# Altium project Instrumentdroid.PrjPcb
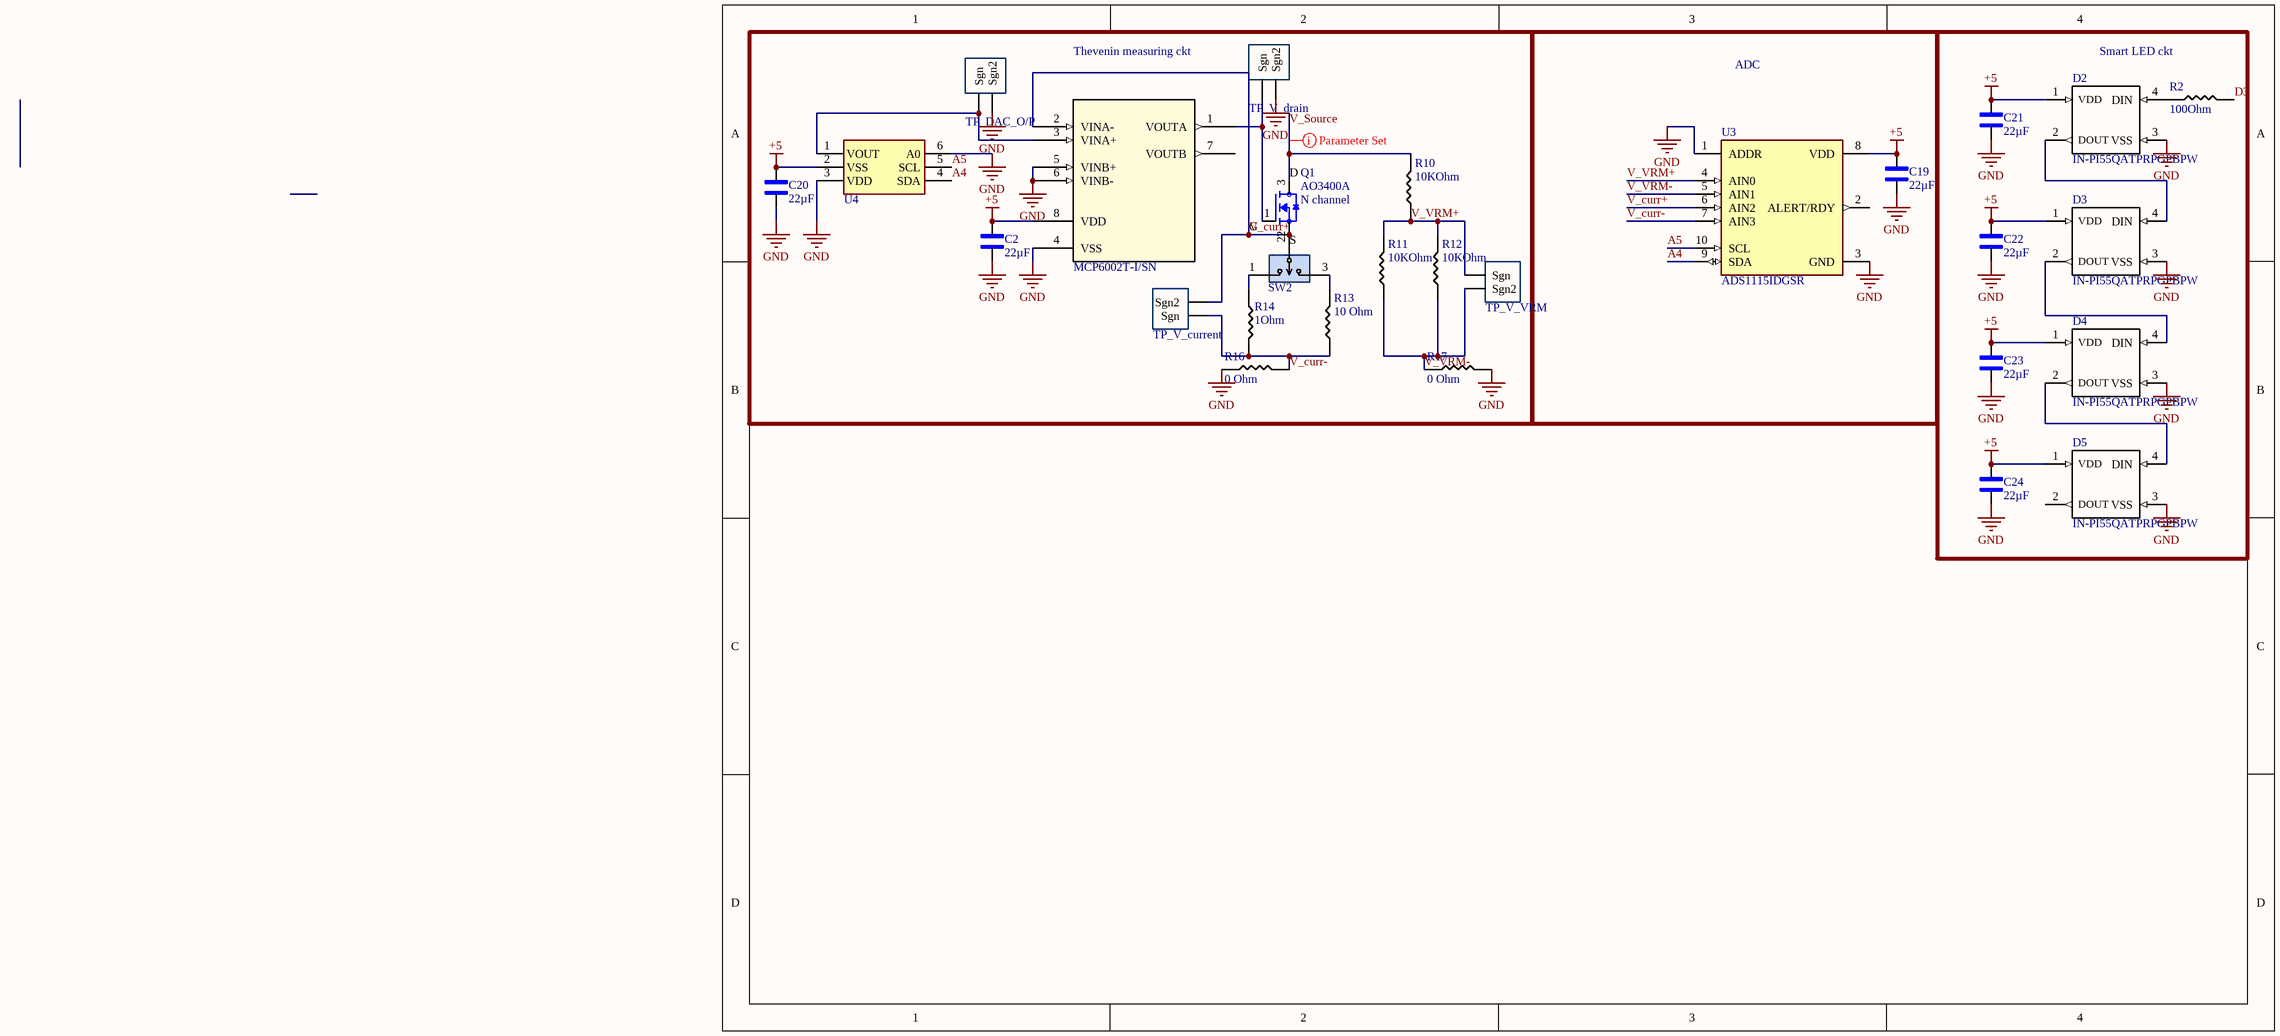
[diagram p0: Sheet2.SchDoc]
2 sheets, 81 parts. Net scope: global (net labels, ports and power ports of the same name join across sheets).
Board file: PCB1_backup1.PcbDoc
Sheets:
  Sheet2.SchDoc
  Sheet3.SchDoc

## Sheet Sheet2.SchDoc
size A4; SheetNumber: 1; SheetTotal: 2

### Parts
?  MCP6002T-I/SN  [SOIC127P600X175-8N]
C2  value 22µF  [1206_Passive_Capacitor]  (hidden comment: C_22uF_1206)
C19  value 22µF  [1206_Passive_Capacitor]  (hidden comment: C_22uF_1206)
C20  value 22µF  [1206_Passive_Capacitor]  (hidden comment: C_22uF_1206)
C21  value 22µF  [1206_Passive_Capacitor]  (hidden comment: C_22uF_1206)
C22  value 22µF  [1206_Passive_Capacitor]  (hidden comment: C_22uF_1206)
C23  value 22µF  [1206_Passive_Capacitor]  (hidden comment: C_22uF_1206)
C24  value 22µF  [1206_Passive_Capacitor]  (hidden comment: C_22uF_1206)
D2  IN-PI55QATPRPGPBPW  [SERIAL_LED - duplicate]
D3  IN-PI55QATPRPGPBPW  [SERIAL_LED - duplicate]
D4  IN-PI55QATPRPGPBPW  [SERIAL_LED - duplicate]
D5  IN-PI55QATPRPGPBPW  [SERIAL_LED - duplicate]
Q1  AO3400A  value N channel  [N-MOSFET]
R2  100Ohm  [1206_Passive_Resitor]
R10  value 10KOhm  [1206_Passive_Resitor]  (hidden comment: 10k)
R11  value 10KOhm  [1206_Passive_Resitor]  (hidden comment: 10k)
R12  value 10KOhm  [1206_Passive_Resitor]  (hidden comment: 10k)
R13  10 Ohm  [1206_Passive_Resitor]
R14  value 1Ohm  [1206_Passive_Resitor]  (hidden comment: 1 Ohm)
R16  0 Ohm  [1206_Passive_Resitor]
R17  0 Ohm  [1206_Passive_Resitor]
SW2  SW_3Pin_100mil_Switch  [3_PIN_100mil]  (value not drawn)
TP_DAC_O/P  10x Probe TP  [TP_Diff_Probe]  (value not drawn)
TP_V_current  10x Probe TP  [TP_Diff_Probe]  (value not drawn)
TP_V_drain  10x Probe TP  [TP_Diff_Probe]  (value not drawn)
TP_V_VRM  10x Probe TP  [TP_Diff_Probe]  (value not drawn)
U3  ADS1115IDGSR  [ADC_ADS1115IDGSR]
U4  DAC IC  [MCP4725]  (value not drawn)

### Blocks framed on the sheet
Thevenin measuring ckt: ? C2 C20 Q1 R10-R14 R16 R17 SW2 TP_DAC_O/P TP_V_current TP_V_drain TP_V_VRM U4
ADC: C19 U3
Smart LED ckt: C21-C24 D2-D5 R2

### Nets
+5: ?.8(VDD) C2.1 C19.1 C20.1 C21.1 C22.1 C23.1 C24.1 D2.1(VDD) D3.1(VDD) D4.1(VDD) D5.1(VDD) U3.8(VDD) U4.2(VSS)
GND: ?.4(VSS) ?.5(VINB+) ?.6(VINB-) C2.2 C19.2 C20.2 C21.2 C22.2 C23.2 C24.2 D2.3(VSS) D3.3(VSS) D4.3(VSS) D5.3(VSS) R16.1 R17.2 TP_DAC_O/P.2(Sgn2) TP_V_drain.2(Sgn2) U3.1(ADDR) U3.3(GND) U4.3(VDD) U4.6(A0)
A4: U3.9(SDA) U4.4(SDA)
A5: U3.10(SCL) U4.5(SCL)
D3: R2.2
V_curr+: ?.2(VINA-) Q1.2(S) SW2.2 TP_V_current.2(Sgn2) U3.6(AIN2)
V_curr-: R13.1 R14.2 R16.2 TP_V_current.1(Sgn) U3.7(AIN3)
V_Source: Q1.3(D) R10.2
V_VRM+: R10.1 R11.2 R12.2 TP_V_VRM.1(Sgn) U3.4(AIN0)
V_VRM-: R11.1 R12.1 R17.1 TP_V_VRM.2(Sgn2) U3.5(AIN1)
Net?_1: ?.1(VOUTA) Q1.1(G) TP_V_drain.1(Sgn)
Net?_3: ?.3(VINA+) TP_DAC_O/P.1(Sgn) U4.1(VOUT)
NetD2_2: D2.2(DOUT) D3.4(DIN)
NetD2_4: D2.4(DIN) R2.1
NetD3_2: D3.2(DOUT) D4.4(DIN)
NetD4_2: D4.2(DOUT) D5.4(DIN)
NetR13_2: R13.2 SW2.3
NetR14_1: R14.1 SW2.1

Not connected (* = marked no-connect by the designer): ? 7(VOUTB); D5 2(DOUT); U3 2(ALERT/RDY)

### Layout directives
rule Width Constraint [Pref Width = 20mil    Min Width = 20mil    Max Width = 20mil]: V_Source

### Library data of the parts
? = U_MCP6002T-I/SN: 0.6 V/us 2 1MHz 1.8V ~ 6V 100μA General Purpose SOIC-8_150mil  Operational Amplifier ROHS; Mfr: Microchip; MFR Part #: MCP6002T-I/SN; DataSheet: https://ww1.microchip.com/downloads/en/DeviceDoc/MCP6001-1R-1U-2-4-1-MHz-Low-Power-Op-Amp-DS20001733L.pdf; LCSC Part#: C7377; Type: Basic
C2 C19-C24 = CMP-001-00089-1: 22uF ±10% 25V X5R 1206 Multilayer Ceramic Capacitors MLCC - SMD/SMT RoHS; MFR Part #: CL31A226KAHNNNE; Type: basic; Design Item ID: C_22uF_1206; Datasheet: https://datasheet.lcsc.com/lcsc/1811031514_Samsung-Electro-Mechanics-CL31A226KAHNNNE_C12891.pdf; LCSC Part#: C12891; Component Type: Standard; Pins: 2; Source: ECEN5730Lib_2023_05_DS.SchLib
D2-D5 = LED_Smart: LIGHT EMITTING DIODES (LED) RGB 620~630NM RED, 520~530NM GREEN, 465~475NM BLUE 600MCD@16MARED,1200MCD@16MAGREEN,300MCD@16MABLUE TOP VIEW SMD-4 ROHS; MFR Part #: XL-5050RGBC-WS2812B; Manufacturer: XINGLIGHT; LCSC Part#: C2843785; DataSheet: https://datasheet.lcsc.com/lcsc/2301111130_XINGLIGHT-XL-5050RGBC-WS2812B_C2843785.pdf
Q1 = Q_Nch_MOSFET: MOSFET N Trench 30V 5.7A 1.5V @ 250uA 26.5 m? @ 5.7A,10V SOT-23-3L RoHS; Type: Basic; LCSC Part#: C20917; Datasheet: https://datasheet.lcsc.com/szlcsc/Alpha-Omega-Semicon-AOS-AO3400A_C20917.pdf; MFR Part #: AO3400A
R2 = R_100Ohm_1206: 100Ω ±1% 0.25W ±100ppm/℃ 1206 Chip Resistor - Surface Mount RoHS; MFR Part #: 1206W4F1000T5E; LCSC Part#: C17901; Datasheet: https://datasheet.lcsc.com/lcsc/2206010145_UNI-ROYAL-Uniroyal-Elec-1206W4F1000T5E_C17901.pdf; Type: Basic; Value: 100Ohm
R10-R12 = R_10KOhm_1206: 10 kOhms ±5% 0.25W, 1/4W Chip Resistor 1206 (3216 Metric) Automotive AEC-Q200 Thick Film; MFR Part #: RMCF1206FT10K0; Digikey Link: https://www.digikey.com/en/products/detail/stackpole-electronics-inc/RMCF1206FT10K0/1759669; LCSC Part#: C17902; Type: Basic
R13 = R_10Ohm_1206: CHIP RESISTOR - SURFACE MOUNT 0.1OHMS ±1% 1/4W 1206 ROHS; MFR Part #: 1206W4F100JT5E; Datasheet: https://datasheet.lcsc.com/szlcsc/Uniroyal-Elec-1206W4F100JT5E_C17903.pdf; LCSC Part#: C17903; Type: Basic; Value: 10 Ohm
R14 = R_1Ohm_1206: 1Ω ±5% 0.25W ±400ppm/℃ 1206 Chip Resistor - Surface Mount RoHS; MFR Part #: 1206W4J010JT5E; LCSC Part#: C1409; Datasheet: https://datasheet.lcsc.com/lcsc/1810301410_UNI-ROYAL-Uniroyal-Elec-1206W4J010JT5E_C1409.pdf; Type: Extended
R16 R17 = R_0Ohm_1206: CHIP RESISTOR - SURFACE MOUNT 0OHMS ±1% 1/4W 1206 ROHS; MFR Part #: 1206W4F0000T5E; Datasheet: https://datasheet.lcsc.com/szlcsc/Uniroyal-Elec-1206W4F0000T5E_C17888.pdf; LCSC Part#: C17888; Type: Basic; Mouser link: https://www.mouser.com/ProductDetail/Royalohm/1206W4F0000T5E?qs=e8oIoAS2J1Thbopin%252BsagQ%3D%3D; Value: 0 Ohm
SW2 = CMP-002-00126-1: Connector Header Through Hole 3 position 0.100" (2.54mm); MFR Part #: PREC003SAAN-RC; Value: CONN HEADER VERT 3POS 2.54MM; Type: Extended; LCSC Part#: C49257; Source: ECEN5730Lib_2023_05_DS.SchLib; Pins: 3; Design Item ID: SW_3Pin_100mil_Switch; Component Type: Standard; Digikey Link: https://www.digikey.com/product-detail/en/PREC003SAAN-RC/S1012EC-03-ND/2774851/?itemSeq=304982371
TP_DAC_O/P TP_V_current TP_V_drain TP_V_VRM = TP_Diff_Probe: Test Point 300 mil centers
U3 = U_ADC_ADS1115IDGSR: 16-Bit ADC with Integrated MUX, PGA, Comparator, Oscillator, and Reference 10-VSSOP -40 to 125; MFR Part #: ADS1115IDGSR; Package: MSOP-10 Texas Instruments; LCSC Part#: C37593; SnapEDA_Link: https://www.snapeda.com/parts/ADS1115IDGSR/Texas%20Instruments/view-part/?ref=snap; Type: Extended; DigiKey link: https://www.digikey.com/product-detail/en/texas-instruments/ADS1115IDGSR/296-38849-1-ND/5142969?utm_source=snapeda&utm_medium=aggregator&utm_campaign=symbol; Value: *
U4 = U_MCP4725A0T-E/CH: IC DAC 12BIT V-OUT SOT23-6; Datasheet: https://ww1.microchip.com/downloads/en/DeviceDoc/22039d.pdf; LCSC Part#: C144198; type: Extended; MFR Part #: MCP4725A0T-E/CH

## Sheet Sheet3.SchDoc
size A4; SheetNumber: 2; SheetTotal: 2
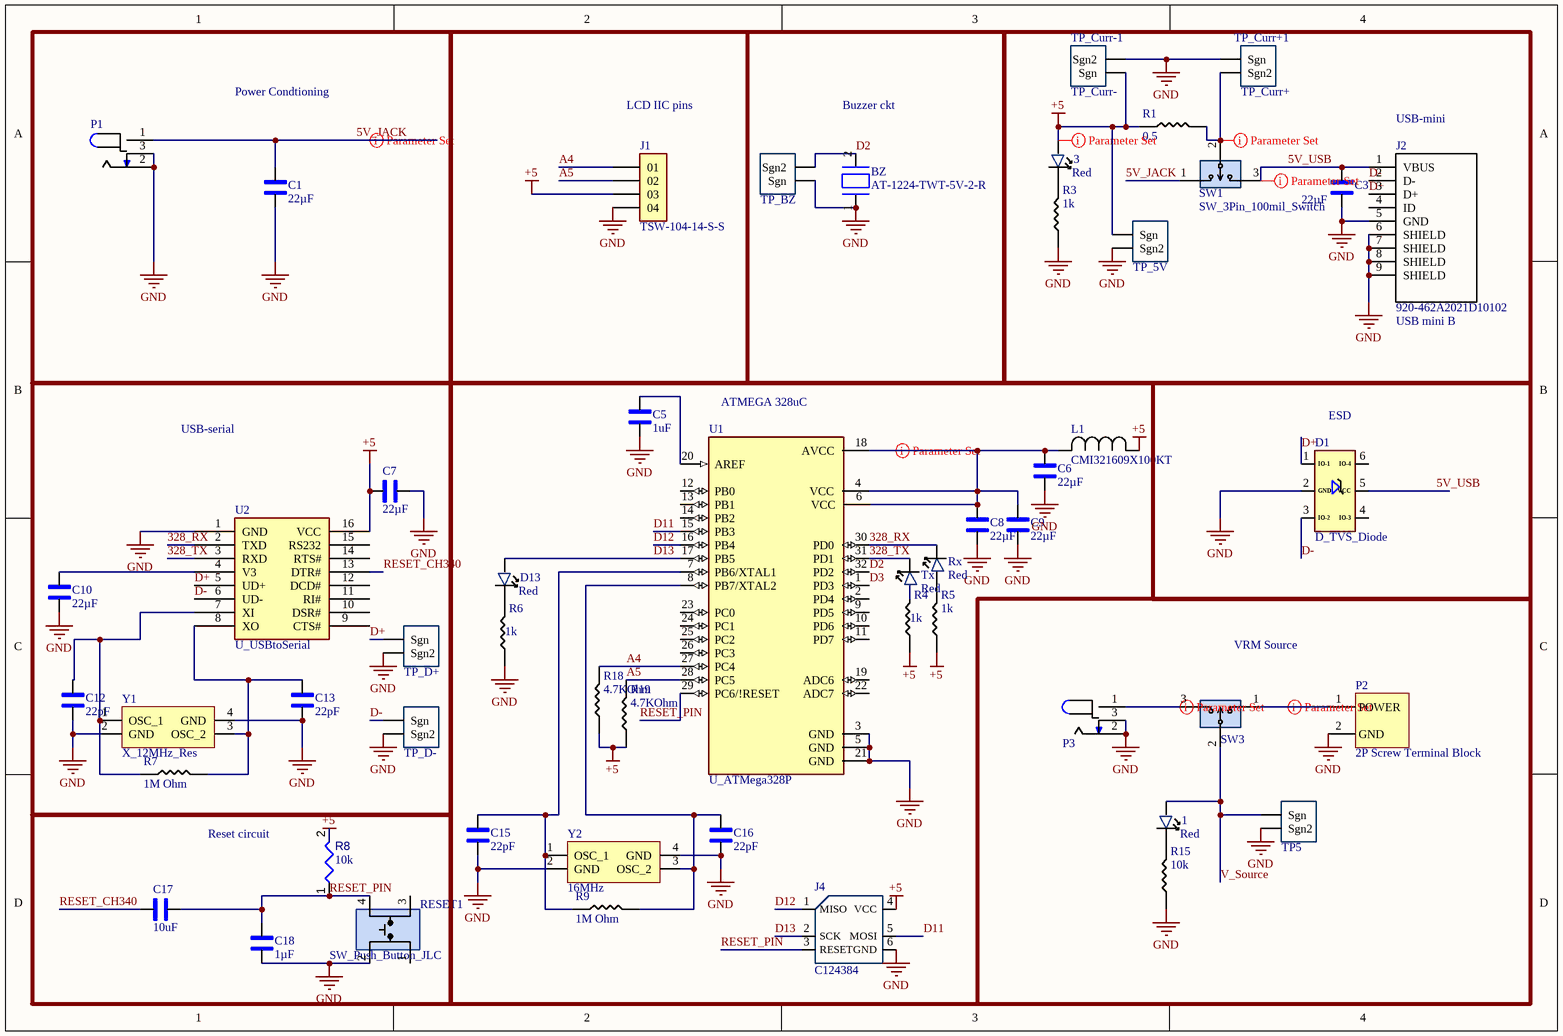
[diagram p1: Sheet3.SchDoc]

### Parts
1  value Red  [LED_1206]  (hidden comment: LED_RED_1206)
3  value Red  [LED_1206]  (hidden comment: LED_RED_1206)
BZ  AT-1224-TWT-5V-2-R  [BUZZER- TH]
C1  value 22µF  [1206_Passive_Capacitor]  (hidden comment: C_22uF_1206)
C3  value 22µF  [1206_Passive_Capacitor]  (hidden comment: C_22uF_1206)
C5  1uF  [1206_Passive_Capacitor]
C6  value 22µF  [1206_Passive_Capacitor]  (hidden comment: C_22uF_1206)
C7  value 22µF  [1206_Passive_Capacitor]  (hidden comment: C_22uF_1206)
C8  value 22µF  [1206_Passive_Capacitor]  (hidden comment: C_22uF_1206)
C9  value 22µF  [1206_Passive_Capacitor]  (hidden comment: C_22uF_1206)
C10  value 22µF  [1206_Passive_Capacitor]  (hidden comment: C_22uF_1206)
C12  value 22pF  [1206_Passive_Capacitor]  (hidden comment: C_22uF_1206)
C13  value 22pF  [1206_Passive_Capacitor]  (hidden comment: C_22uF_1206)
C15  value 22pF  [1206_Passive_Capacitor]  (hidden comment: C_22uF_1206)
C16  value 22pF  [1206_Passive_Capacitor]  (hidden comment: C_22uF_1206)
C17  10uF  [1206_Passive_Capacitor]
C18  value 1µF  [1206_Passive_Capacitor]  (hidden comment: C_1uF_1206)
D1  D_TVS_Diode  [TVS]
D13  value Red  [LED_1206]  (hidden comment: LED_RED_1206)
J1  TSW-104-14-S-S  [JM-4_TSW-104-14-S-S]
J2  value USB mini B  MFR Part #: 920-462A2021D10102  [USB_MINI_B]  (hidden comment: J_USB_B_Mini)
J4  LCSC Part#: C124384  [ICSP]  (hidden comment: NRPN032PAEN-RC)
L1  MFR PART #: CMI321609X100KT  [AIML-1206_ABR-M]  (hidden comment: FB_10uH_1206)
P1  P_Power Jack  [Power_Jack]  (value not drawn)
P2  2P Screw Terminal Block  [P_Terminal block 3.5mm-pitch]
P3  Power Jack  [Power_Jack]  (value not drawn)
R1  value 0.5  [1206_Passive_Resitor]  (hidden comment: R_500mOhm_1206)
R3  value 1k  [1206_Passive_Resitor]  (hidden comment: R_1K_1206)
R4  value 1k  [1206_Passive_Resitor]  (hidden comment: R_1K_1206)
R5  value 1k  [1206_Passive_Resitor]  (hidden comment: R_1K_1206)
R6  value 1k  [1206_Passive_Resitor]  (hidden comment: R_1K_1206)
R7  value 1M Ohm  [1206_Passive_Resitor]  (hidden comment: 1M)
R8  value 10k  [RESC3216X60X45ML15T20]  (hidden comment: Resistor 10k +/-1% 1206 250 mW)
R9  value 1M Ohm  [1206_Passive_Resitor]  (hidden comment: 1M)
R15  value 10k  [1206_Passive_Resitor]  (hidden comment: R_10K_1206)
R18  4.7KOhm  [1206_Passive_Resitor]
R19  4.7KOhm  [1206_Passive_Resitor]
RESET1  SW_Push_Button_JLC  [Switch_JLC]
Rx  value Red  [LED_1206]  (hidden comment: LED_RED_1206)
SW1  SW_3Pin_100mil_Switch  [3_PIN_100mil]
SW3  SW_3Pin_100mil_Switch  [3_PIN_100mil]  (value not drawn)
TP5  10x Probe TP  [TP_Diff_Probe]  (value not drawn)
TP_5V  10x Probe TP  [TP_Diff_Probe]  (value not drawn)
TP_BZ  10x Probe TP  [TP_Diff_Probe]  (value not drawn)
TP_Curr+1  TP_Curr+  [TP_Diff_Probe]
TP_Curr-1  TP_Curr-  [TP_Diff_Probe]
TP_D+  10x Probe TP  [TP_Diff_Probe]  (value not drawn)
TP_D-  10x Probe TP  [TP_Diff_Probe]  (value not drawn)
Tx  value Red  [LED_1206]  (hidden comment: LED_RED_1206)
U1  U_ATMega328P  [ATMega328P]
U2  U_USBtoSerial  [USB to serial]
Y1  X_12MHz_Res  [Crystal resonator]
Y2  value 16MHz  [Crystal resonator]  (hidden comment: X322516MLB4SI)

### Blocks framed on the sheet
Power Condtioning: C1 P1
Buzzer ckt: BZ TP_BZ
LCD IIC pins: J1
USB-mini: 3 C3 J2 R1 R3 SW1 TP_5V TP_Curr+1 TP_Curr-1
USB-serial: C7 C10 C12 C13 R7 TP_D+ TP_D- U2 Y1
ATMEGA 328uC: C5 C6 C8 C9 C15 C16 D13 J4 L1 R4-R6 R9 R18 R19 Rx Tx U1 Y2
ESD: D1
VRM Source: 1 P2 P3 R15 SW3 TP5
Reset circuit: C17 C18 R8 RESET1

### Nets
+5: 3.1 C7.1 J1.03 J4.4(VCC) L1.1 R1.1 R4.1 R5.1 R8.2 R18.1 R19.1 TP_5V.1(Sgn) TP_Curr-1.1(Sgn) U2.16(VCC)
GND: BZ.1(BZ1) C1.1 C3.1 C5.2 C6.1 C7.2 C8.1 C9.1 C10.2 C12.1 C13.1 C15.1 C16.1 C18.1 D1.2(GND) J1.04 J2.5(GND) J2.6(SHIELD) J2.7(SHIELD) J2.8(SHIELD) J2.9(SHIELD) J4.6(GND) P1.2 P1.3 P2.2(GND) P3.2 P3.3 R3.1 R6.1 R15.1 RESET1.2 TP5.2(Sgn2) TP_5V.2(Sgn2) TP_BZ.1(Sgn) TP_Curr+1.1(Sgn) TP_Curr-1.2(Sgn2) TP_D+.2(Sgn2) TP_D-.2(Sgn2) U1.3(GND) U1.5(GND) U1.21(GND) U2.1(GND) Y1.2(GND) Y1.4(GND) Y2.2(GND) Y2.4(GND)
5V_JACK: C1.2 P1.1 SW1.1
5V_USB: C3.2 D1.5(VCC) J2.1(VBUS) SW1.3
328_RX: Rx.2 U1.30(PD0) U2.2(TXD)
328_TX: Tx.2 U1.31(PD1) U2.3(RXD)
A4: J1.01 R18.2 U1.27(PC4)
A5: J1.02 R19.2 U1.28(PC5)
D2: BZ.2(BZ2) TP_BZ.2(Sgn2) U1.32(PD2)
D3: U1.1(PD3)
D11: J4.5(MOSI) U1.15(PB3)
D12: J4.1(MISO) U1.16(PB4)
D13: D13.1 J4.2(SCK) U1.17(PB5)
D+: D1.1(IO-1) J2.3(D+) TP_D+.1(Sgn) U2.5(UD+)
D-: D1.3(IO-2) J2.2(D-) TP_D-.1(Sgn) U2.6(UD-)
RESET_CH340: C17.1 U2.13(DTR#)
RESET_PIN: C17.2 C18.2 J4.3(RESET) R8.1 RESET1.4 U1.29(PC6/!RESET)
V_Source: 1.1 SW3.2 TP5.1(Sgn)
Net1_2: 1.2 R15.2
Net3_2: 3.2 R3.2
NetC5_1: C5.1 U1.20(AREF)
NetC6_2: C6.2 C8.2 C9.2 L1.2 U1.4(VCC) U1.6(VCC) U1.18(AVCC)
NetC10_1: C10.1 U2.4(V3)
NetC12_2: C12.2 R7.1 U2.7(XI) Y1.1(OSC_1)
NetC13_2: C13.2 R7.2 U2.8(XO) Y1.3(OSC_2)
NetC15_2: C15.2 R9.1 U1.7(PB6/XTAL1) Y2.1(OSC_1)
NetC16_2: C16.2 R9.2 U1.8(PB7/XTAL2) Y2.3(OSC_2)
NetD13_2: D13.2 R6.2
NetP2_1: P2.1(POWER) SW3.1
NetP3_1: P3.1 SW3.3
NetR1_2: R1.2 SW1.2 TP_Curr+1.2(Sgn2)
NetR4_2: R4.2 Tx.1
NetR5_2: R5.2 Rx.1

Not connected (* = marked no-connect by the designer): D1 4(IO-3) 6(IO-4); J2 4(ID); RESET1 1 3; U1 2(PD4) 9(PD5) 10(PD6) 11(PD7) 12(PB0) 13(PB1) 14(PB2) 19(ADC6) 22(ADC7) 23(PC0) 24(PC1) 25(PC2) 26(PC3); U2 9(CTS#) 10(DSR#) 11(RI#) 12(DCD#) 14(RTS#) 15(RS232)

### Layout directives
rule Width Constraint [Pref Width = 20mil    Min Width = 20mil    Max Width = 30mil]: 5V_JACK, 5V_USB, +5, NetC6_2, NetR1_2
rule Width Constraint [Pref Width = 20mil    Min Width = 20mil    Max Width = 20mil]: NetP2_1, NetP3_1

### Library data of the parts
1 3 Rx Tx = CMP-007-00045-1: Red 621~631nm 1206 Light Emitting Diodes (LED) RoHS; MFR Part #: 15-21/R6C-FQ1R1B/2T; Source: ECEN5730Lib_2023_05_DS.SchLib; LCSC Part#: C93133; Design Item ID: LED_RED_1206; Type: Extended; Pins: 2; Component Type: Standard; Datasheet: https://datasheet.lcsc.com/szlcsc/1811151241_Everlight-Elec-15-21-R6C-FQ1R1B-2T_C93133.pdf
BZ = BUZZER_1: Buzzers Transducer, Externally Driven Electromechanical/Magnetic 5 V 40mA 2.4kHz 87dB @ 5V, 10cm Through Hole PC Pins; Datasheet: https://www.puiaudio.com/media/SpecSheet/AT-1224-TWT-5V-2-R.pdf; MFR Part #: AT-1224-TWT-5V-2-R
C1 C3 C7 C10 C12 C13 C15 C16 = CMP-001-00089-1: as C2 on sheet Sheet2; Design Item ID: C_22uF_1206; Datasheet: https://datasheet.lcsc.com/lcsc/1811031514_Samsung-Electro-Mechanics-CL31A226KAHNNNE_C12891.pdf; LCSC Part#: C12891; Component Type: Standard; Pins: 2; Source: ECEN5730Lib_2023_05_DS.SchLib
C5 = C_1uF_1206: MULTILAYER CERAMIC CAPACITORS MLCC - SMD/SMT 1UF 50V 1206 ROHS; MFR Part #: CL31B105KBHNNNE; Type: Basic; Digikey Link: https://www.digikey.com/product-detail/en/C1206C105M4RACTU/399-8150-1-ND/3471873/?itemSeq=304982366; LCSC Part#: C1848; Value: 1uF
C6 C8 C9 = CMP-001-00098-1: 22uF ±10% 25V X5R 1206 Multilayer Ceramic Capacitors MLCC - SMD/SMT RoHS; MFR Part #: CL31A226KAHNNNE; Type: basic; Design Item ID: C_22uF_1206; LCSC Part#: C12891; Datasheet: https://datasheet.lcsc.com/lcsc/1811031514_Samsung-Electro-Mechanics-CL31A226KAHNNNE_C12891.pdf; Pins: 2; Component Type: Standard; Source: ECEN5730Lib_2023_05_DS.SchLib
C17 = C_10uF_1206: 10uF ±10% 50V X5R 1206 Multilayer Ceramic Capacitors MLCC - SMD/SMT RoHS; MFR Part #: CL31A106KBHNNNE; Type: Basic; LCSC Part#: C13585; Datasheet: https://datasheet.lcsc.com/lcsc/1810221112_Samsung-Electro-Mechanics-CL31A106KBHNNNE_C13585.pdf; Value: 10uF
C18 = CMP-001-00095-1: MULTILAYER CERAMIC CAPACITORS MLCC - SMD/SMT 1UF 50V 1206 ROHS; MFR Part #: CL31B105KBHNNNE; Type: Basic; Source: ECEN5730Lib_2023_05_DS.SchLib; Pins: 2; Digikey Link: https://www.digikey.com/product-detail/en/C1206C105M4RACTU/399-8150-1-ND/3471873/?itemSeq=304982366; LCSC Part#: C1848; Component Type: Standard; Design Item ID: C_1uF_1206
D1 = CMP-004-00031-1: TVS SOT-23-6 ROHS; MFR Part #: SRV05-4-P-T7; Type: Basic; Value: TVS DIODE 5.5V 6TSOP; LCSC Part#: C85364; Pins: 6; Design Item ID: D_TVS_Diode; Datasheet: https://datasheet.lcsc.com/szlcsc/ProTek-Devices-SRV05-4-P-T7_C85364.pdf; Component Type: Standard; Source: ECEN5730Lib_2023_05_DS.SchLib
D13 = CMP-007-00045-1: Red 621~631nm 1206 Light Emitting Diodes (LED) RoHS; MFR Part #: 15-21/R6C-FQ1R1B/2T; Type: Extended; Source: ECEN5730Lib_2023_05_DS.SchLib; LCSC Part#: C93133; Design Item ID: LED_RED_1206; Pins: 2; Component Type: Standard; Datasheet: https://datasheet.lcsc.com/szlcsc/1811151241_Everlight-Elec-15-21-R6C-FQ1R1B-2T_C93133.pdf
J1 = JM_4_PIN_MALE: Square Pins 2.5mm 6mm -40℃~+105℃ 1 4 3mm 2.54mm Black 1x4P Straight,P=2.54mm  Pin Headers ROHS; MFR PART #: PZ254V-11-04P; MP: TSW-104-14-S-S; LCSC PART#: C2691448
J2 = CMP-013-000002-1: Through Hole USB Connectors RoHS; Type: Extended; Design Item ID: J_USB_B_Mini; LCSC Part#: C46398; Pin Count: 9; Component Type: Standard; Datasheet: https://datasheet.lcsc.com/szlcsc/2103081233_Jing-Extension-of-the-Electronic-Co-920-462A2021D10102_C46398.pdf; Source: ECEN5730Lib_2023_05_DS.SchLib
J4 = J_ICSP: Connector Header Through Hole 6 position 0.079" (2.00mm); Digikey Link: https://www.digikey.com/product-detail/en/NRPN032PAEN-RC/S5801-03-ND/804955/?itemSeq=304982355; MFR Part #: NRPN032PAEN-RC; Type: Extended
L1 = CMP-006-00021-1: 25mA 10uH ±10% 800mO 1206  Inductors (SMD) ROHS; Mfr_Name: FH (Guangdong Fenghua Advanced Tech); Type: Basic; LCSC PART#: C1051; Source: ECEN5730Lib_2023_05_DS.SchLib; Pins: 2; Design Item ID: FB_10uH_1206; DataSheet: https://datasheet.lcsc.com/lcsc/1810311314_FH--Guangdong-Fenghua-Advanced-Tech-CMI321609X100KT_C1051.pdf; Component Type: Standard
P1 = CMP-002-00097-1: Power Barrel Connector Jack 2.10mm ID (0.083"), 5.50mm OD (0.217") Through Hole, Right Angle; MFR Part #: PJ-102A; Value: CONN PWR JACK 2X5.5MM SOLDER; Component Type: Standard; LCSC Part#: C136744; Source: ECEN5730Lib_2023_05_DS.SchLib; Type: Extended; Digikey Link: https://www.digikey.com/product-detail/en/PJ-102A/CP-102A-ND/275425/?itemSeq=304982367; Pins: 3; Design Item ID: P_Power Jack
P2 = P_Terminal block: Green Straight pin 3.5mm  pitch; P=3.5mm  Screw terminal ROHS; MFR Part #: KF350-3.5-2P; Manufacturer: Cixi Kefa Elec; LCSC Part#: C474892; DataSheet: https://datasheet.lcsc.com/lcsc/2001160007_Cixi-Kefa-Elec-KF350-3-5-2P_C474892.pdf
P3 = P_Power Jack: Power Barrel Connector Jack 2.10mm ID (0.083"), 5.50mm OD (0.217") Through Hole, Right Angle; MFR Part #: PJ-102A; Value: CONN PWR JACK 2X5.5MM SOLDER; Digikey Link: https://www.digikey.com/product-detail/en/PJ-102A/CP-102A-ND/275425/?itemSeq=304982367; LCSC Part#: C136744; Type: Extended
R1 = CMP-009-00210-1: Resistors/Shunt 250mW 500mO ±800ppm/? ±5% 1206  Current Sense  Resistors ROHS; MFR Part #: 1206W4J050KT5E; Datasheet: https://datasheet.lcsc.com/lcsc/1810301438_UNI-ROYAL-Uniroyal-Elec-1206W4J050KT5E_C247433.pdf; Component Type: Standard; Pins: 2; LCSC Part#: C247433; Design Item ID: R_500mOhm_1206; Type: Extended; Source: ECEN5730Lib_2023_05_DS.SchLib
R3-R6 R15 = CMP-009-00194-1: CHIP RESISTOR - SURFACE MOUNT 1KOHMS ±1% 1/4W 1206 ROHS; MFR Part #: RNCP1206FTD1K00CT; LCSC Part#: C4410; Pins: 2; Source: ECEN5730Lib_2023_05_DS.SchLib; Digikey Link: https://www.digikey.com/product-detail/en/RNCP1206FTD1K00/RNCP1206FTD1K00CT-ND/2240675/?itemSeq=304982373; Type: Basic; Component Type: Standard; Design Item ID: R_1K_1206
R7 R9 = R_1M_1206: CHIP RESISTOR - SURFACE MOUNT 1MOHMS ±1% 1/4W 1206 ROHS; MFR Part #: RMCF1206JT1M00; Digikey Link: https://www.digikey.com/product-detail/en/RMCF1206JT1M00/RMCF1206JT1M00CT-ND/1942830/?itemSeq=304982358; LCSC Part#: C17927; Type: Basic
R8 = CMP-009-00016-5: Chip Resistor, 10 KOhm, +/- 1%, 0.25 W, -55 to 155 degC, 1206 (3216 Metric); Power: 250mW; Voltage Rating: 200V; Pins: 2; Max Operating Temperature: 155°C; Tolerance: 1%; RoHS Compliant: True; Case/Package: 1206; Min Operating Temperature: -55°C; Mounting Technology: SM
R18 R19 = R_4.7k_1206: 4.7kΩ ±1% 0.25W ±100ppm/℃ 1206 Chip Resistor - Surface Mount RoHS; MFR Part #: 1206W4F4701T5E; LCSC Part#: C17936; Datasheet: https://datasheet.lcsc.com/lcsc/1810301414_UNI-ROYAL-Uniroyal-Elec-1206W4F4701T5E_C17936.pdf; Type: Basic; Value: 4.7KOhm
RESET1 = CMP-011-00014-1: Tactile Switch SPST-NO Top Actuated Surface Mount; MFR Part #: KH-4.5X4.5X4.3H-STM; Type: Extended; Pins: 4; DataSheet: https://datasheet.lcsc.com/lcsc/2106081532_Shenzhen-Kinghelm-Elec-KH-4.5X4.5X4.3H-STM_C2837550.pdf; Source: ECEN5730Lib_2023_05_DS.SchLib; Component Type: Standard; Design Item ID: SW_Push_Button_JLC; LCSC Part#: C2837550
SW1 SW3 = CMP-002-00126-1: as SW2 on sheet Sheet2; Type: Extended; LCSC Part#: C49257; Source: ECEN5730Lib_2023_05_DS.SchLib; Pins: 3; Design Item ID: SW_3Pin_100mil_Switch; Component Type: Standard; Digikey Link: https://www.digikey.com/product-detail/en/PREC003SAAN-RC/S1012EC-03-ND/2774851/?itemSeq=304982371
TP5 TP_5V TP_BZ TP_D+ TP_D- = TP_Diff_Probe: Test Point 300 mil centers
TP_Curr+1 TP_Curr-1 = CMP-016-000002-1: Test Point 300 mil centers; Component Type: Standard; Source: ECEN5730Lib_2023_05_DS.SchLib; Pin Count: 2; Design Item ID: TP_Diff_Probe
U1 = CMP-031-00012-1: AVR AVR® ATmega Microcontroller IC 8-Bit 20MHz 32KB (16K x 16) FLASH 32-TQFP (7x7); MFR Part #: ATMEGA328P-AU; Value: IC MCU 8BIT 32KB FLASH 32TQFP; Design Item ID: U_ATMega328P; Pins: 32; Component Type: Standard; Source: ECEN5730Lib_2023_05_DS.SchLib; Type: Basic; LCSC Part#: C14877; DigiKey link: https://www.digikey.com/product-detail/en/ATMEGA328P-ANR/ATMEGA328P-ANRCT-ND/2774230/?itemSeq=304982365
U2 = CMP-031-00016-1: Transceiver USB 2.0 2Mbps SOP-16_150mil USB ICs RoHS; MFR Part #: CH340G; Value: USB to Serial; Component Type: Standard; LCSC Part#: C14267; Design Item ID: U_USBtoSerial; Type: Basic; Datasheet: https://datasheet.lcsc.com/lcsc/2008191806_WCH-Jiangsu-Qin-Heng-CH340G_C14267.pdf; Source: ECEN5730Lib_2023_05_DS.SchLib; Pins: 16
Y1 = CMP-003-00030-1: SMD Crystal Resonators 12MHz ±10ppm SMD-3225_4P RoHS; MFR Part #: X322512MSB4SI; Design Item ID: X_12MHz_Res; Type: Basic; Pins: 4; Value: 12MHz; Datasheet: https://datasheet.lcsc.com/szlcsc/Yangxing-Tech-X322512MSB4SI_C9002.pdf; Source: ECEN5730Lib_2023_05_DS.SchLib; LCSC Part#: C9002; Component Type: Standard
Y2 = X_16Mhz_Res: ±10ppm 16000000Hz -40℃~85℃ 贴片无源晶振 60Ω 9pF SMD3225-4P Crystals ROHS; LCSC Part#: C13738; MFR Part #: X322516MLB4SI; Type: Basic

## Nets that join several sheets
+5: Sheet2 (14 pins), Sheet3 (14 pins)
GND: Sheet2 (22 pins), Sheet3 (46 pins)
A4: Sheet2 (U3.9 U4.4), Sheet3 (J1.01 R18.2 U1.27)
A5: Sheet2 (U3.10 U4.5), Sheet3 (J1.02 R19.2 U1.28)
D3: Sheet2 (R2.2), Sheet3 (U1.1)
V_Source: Sheet2 (Q1.3 R10.2), Sheet3 (1.1 SW3.2 TP5.1)